# Altium project Nedjabar.PrjPcb
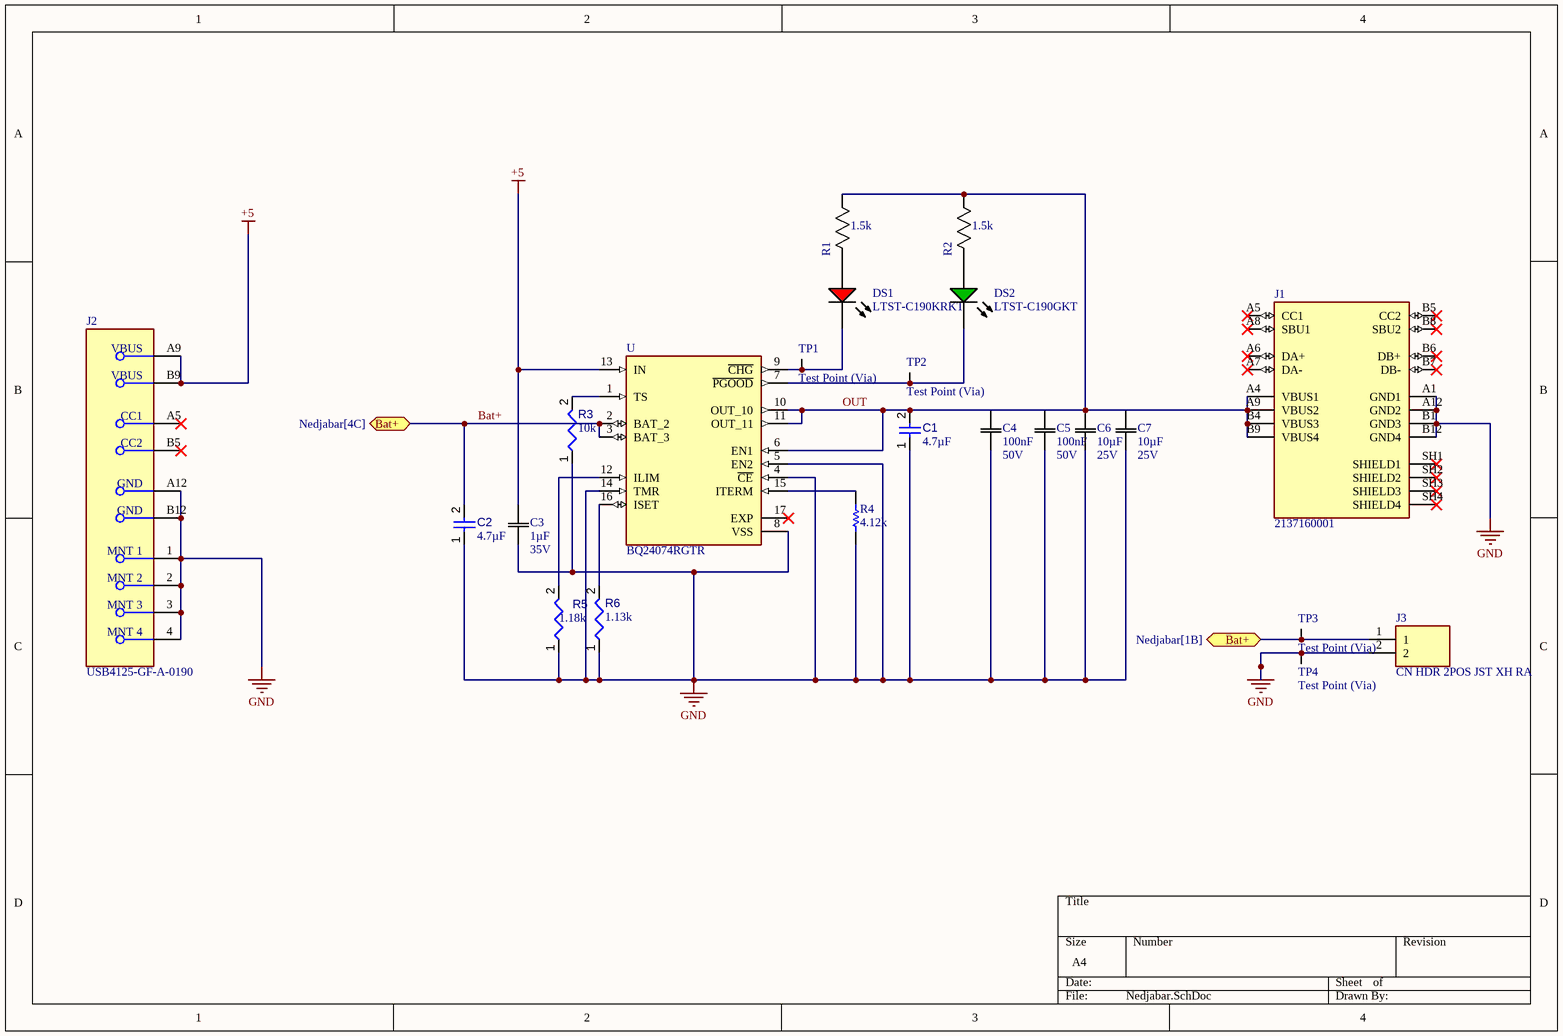
[diagram p0: Nedjabar.SchDoc]
1 sheet, 23 parts. Net scope: flat (ports and power ports of the same name join across sheets).

## Sheet Nedjabar.SchDoc
size A4; SheetNumber: 1; SheetTotal: 1

### Parts
C1  value 4.7µF  [CAPC0805(2012)145_L]  (hidden comment: Capacitor 4.7µF +/-40% 25V 0805)
C2  value 4.7µF  [CAPC0805(2012)145_L]  (hidden comment: Capacitor 4.7µF +/-40% 25V 0805)
C3  value 1µF  Rating: 35V  [0805]  (hidden comment: CAP 1.0uF 35V)
C4  value 100nF  Rating: 50V  [0603]  (hidden comment: CAP 0.1uF 50V)
C5  value 100nF  Rating: 50V  [0603]  (hidden comment: CAP 0.1uF 50V)
C6  value 10µF  Rating: 25V  [1206]  (hidden comment: CAP 10uF 25V)
C7  value 10µF  Rating: 25V  [1206]  (hidden comment: CAP 10uF 25V)
DS1  LTST-C190KRKT  [LTST-C191KRKT_V]
DS2  LTST-C190GKT  [LTST-C190GKT_V]
J1  2137160001  [MOLEX_2137160001]
J2  USB4125-GF-A-0190  [FP-USB4125-GF-A-0190-MFG]
J3  CN HDR 2POS JST XH RA  [JST_S2B-XH-A(LF)(SN)]
R1  value 1.5k  [0603]  (hidden comment: RES 1.5k 1/8W - 1%)
R2  value 1.5k  [0603]  (hidden comment: RES 1.5k 1/8W - 1%)
R3  value 10k  [RESC2013X50X35ML15T15]  (hidden comment: Resistor 10k +/-1% 0805 125 mW)
R4  value 4.12k  [RESC2013X60X35NL10T20]  (hidden comment: Resistor 4k12 +/- 1% 0805)
R5  value 1.18k  [0805 IPC Class B]  (hidden comment: 0603-(1608-Metric))
R6  value 1.13k  [0805 IPC Class B]  (hidden comment: CRCW08051K13FKEA)
TP1  Test Point (Via)  [TP]  (no BOM)
TP2  Test Point (Via)  [TP]  (no BOM)
TP3  Test Point (Via)  [TP]  (no BOM)
TP4  Test Point (Via)  [TP]  (no BOM)
U  BQ24074RGTR  [QFN50P300X300X100-17N]

### Ports
Bat+ (bidir, see Nedjabar[1B]), Bat+ (bidir, see Nedjabar[4C])

### Nets
+5: C3.2(C2) J2.A9(VBUS) J2.B9(VBUS) U.13(IN)
GND: C1.1 C2.1 C3.1(C1) C4.1(C1) C5.1(C1) C6.1(C1) C7.1(C1) J1.A1(GND1) J1.A12(GND2) J1.B1(GND3) J1.B12(GND4) J2.1(MNT_1) J2.2(MNT_2) J2.3(MNT_3) J2.4(MNT_4) J2.A12(GND) J2.B12(GND) J3.2 R3.1 R4.1 R5.1 R6.1 TP4.1 U.4(~{CE}) U.5(EN2) U.8(VSS) U.14(TMR)
Bat+: C2.2 J3.1 TP3.1 U.2(BAT_2) U.3(BAT_3) ; port Bat+
OUT: C1.2 C4.2(C2) C5.2(C2) C6.2(C2) C7.2(C2) J1.A4(VBUS1) J1.A9(VBUS2) J1.B4(VBUS3) J1.B9(VBUS4) R1.1(R1) R2.1(R1) U.6(EN1) U.10(OUT_10) U.11(OUT_11)
NetDS1_1: DS1.1(A) R1.2(R2)
NetDS1_2: DS1.2(K) TP1.1 U.9(~{CHG})
NetDS2_1: DS2.1(A) R2.2(R2)
NetDS2_2: DS2.2(K) TP2.1 U.7(~{PGOOD})
NetR3_2: R3.2 U.1(TS)
NetR4_2: R4.2 U.15(ITERM)
NetR5_2: R5.2 U.12(ILIM)
NetR6_2: R6.2 U.16(ISET)

Not connected (* = marked no-connect by the designer): J1 A5(CC1)* A6(DA+)* A7(DA-)* A8(SBU1)* B5(CC2)* B6(DB+)* B7(DB-)* B8(SBU2)* SH1(SHIELD1)* SH2(SHIELD2)* SH3(SHIELD3)* SH4(SHIELD4)*; J2 A5(CC1)* B5(CC2)*; U 17(EXP)*

### Library data of the parts
C1 C2 = CMP-001-00080-4: Chip Capacitor, 4.7µF +/-40%, 25V, 0805, Thickness 1.45 mm; Tolerance: 20%; Voltage Rating: 25V; Min Operating Temperature: -55°C; Max Operating Temperature: 85°C; Pins: 2; Mounting Technology: SMT; Case/Package: 0805
C3 = CMP-001-00115-1: Temperature Coefficient: X7R; Tolerance: 10%; Part Number: CAP 1.0uF 35V
C4 C5 = CMP-001-00131-1: Tolerance: 10%; Temperature Coefficient: X7R; Part Number: CAP 0.1uF 50V
C6 C7 = CMP-001-00127-1: Temperature Coefficient: X5R; Tolerance: 10%; Part Number: CAP 10uF 25V
DS1 = CMP-007-00024-2: LED Uni-Color Red, 62.5 mW, 25 mA, -30 to 85 degC, 2-Pin SMD, RoHS, Tape and Reel; Manufacturer: Lite-On; Power: 75mW; Forward Voltage: 2V; Luminous Intensity: 54mcd; Lens Style: Diffused; Viewing Angle: 130degrees; Forward Current: 20mA; Manufacturer URL: http://www.us.liteon.com/; Case/Package: 0603; Datasheet Version: Rev. F, 05/2013; Package Reference: C191KRKT; Datasheet URL: http://optoelectronics.liteon.com/upload/download/DS-22-99-0151/S_110_LTST-C190KRKT.pdf; Package Description: 2-Pin Surface Mount Device, Body 1.6 x 0.8 mm; Nominal Vf: 2V; Packaging: TapeandReel; RoHS Compliant: True; Pins: 2; Illumination Colour: Red; Colour: Red; Mounting Technology: SM; Package Quantity: 3000; Min Operating Temperature: -55°C; Max Operating Temperature: 85°C
DS2 = CMP-007-00022-2: LED Uni-Color Green, 100 mW, 30 mA, -55 to 85 degC, 2-Pin SMD, RoHS, Tape and Reel; Manufacturer: Lite-On; Power: 100mW; Forward Voltage: 2.1V; Viewing Angle: 130degrees; Forward Current: 20mA; Luminous Intensity: 6mcd; Lens Style: Clear; Manufacturer URL: http://www.us.liteon.com/; RoHS Compliant: True; Colour: Green; Package Description: 2-Pin Surface Mount Device, Body 1.6 x 0.8 mm; Datasheet URL: http://datasheet.octopart.com/LTST-C190GKT-Lite-On-datasheet-158530.pdf; Datasheet Version: Dec-06; Mounting Technology: SM; Case/Package: 0603; Package Reference: C190GKT; Packaging: TapeandReel; Min Operating Temperature: -55°C; Nominal Vf: 2.1V; Package Quantity: 3000; Illumination Colour: Green; Max Operating Temperature: 85°C; Pins: 2
J1 = 2137160001: USB-C (USB TYPE-C) USB 2.0 Receptacle Connector 24 (16+8 Dummy) Position Through Hole, Right Angle; MF: Molex; SnapEDA_Link: https://www.snapeda.com/parts/2137160001/Molex/view-part/?ref=snap; Package: None; Value: *; MP: 2137160001; Check_prices: https://www.snapeda.com/parts/2137160001/Molex/view-part/?ref=eda
J2 = CMP-245163-000004-1: CONN RCPT TYPE C 6P SMD RA
J3 = CMP-002-00105-1: Pins: 2; Part Number: CN HDR 2POS JST XH RA
R1 R2 = CMP-009-00189-1: Part Number: RES 1.5k 1/8W - 1%
R3 = CMP-009-00018-6: Chip Resistor, 10 KOhm, +/- 1%, 125 mW, -55 to 155 degC, 0805 (2012 Metric); Voltage Rating: 150V; Power: 125mW; RoHS Compliant: True; Case/Package: 0805; Tolerance: 1%; Pins: 2; Mounting Technology: SM; Max Operating Temperature: 155°C; Min Operating Temperature: -55°C
R4 = CMP-009-00396-1: Fixed Resistor, Metal Glaze/thick Film, 0.125W, 4120ohm, 150V, 1% +/-Tol, 100ppm/Cel, Surface Mount, 0805; Power: 125mW; Case/Package: 0805; Mounting Technology: Surface Mount; Pins: 2; Min Operating Temperature: -55°C; RoHS Compliant: Yes; Max Operating Temperature: 155°C; Tolerance: 1%
R5 = CMP-009-00397-1: Fixed Resistor, Metal Glaze/thick Film, 0.125W, 1180ohm, 150V, 1% +/-Tol, 100ppm/Cel, Surface Mount, 0805; Power: 125mW; Case/Package: 0805; RoHS Compliant: Yes; Tolerance: 1%; Pins: 2; Mounting Technology: Surface Mount; Min Operating Temperature: -55°C; Max Operating Temperature: 155°C
R6 = CMP-009-00401-1: Fixed Resistor, Metal Glaze/thick Film, 0.125W, 1130ohm, 150V, 1% +/-Tol, 100ppm/Cel, Surface Mount, 0805; Power: 125mW; Max Operating Temperature: 155°C; Mounting Technology: Surface Mount; RoHS Compliant: Yes; Pins: 2; Min Operating Temperature: -55°C; Tolerance: 1%; Case/Package: 0805
TP1-TP4 = CMP-024-000001-1: Part Number: Test Point (Via)
U = BQ24074RGTR: Standalone 1-cell 1.5-A linear charger, Power Path, 4.2-V VBAT, 10.5-V OVP and 4.4-V VOUT 16-VQFN -40 to 85; MF: Texas Instruments; Texas_Instruments-Purchase-URL: https://snapeda.com/shop?store=Texas+Instruments&id=231063; Mouser-Purchase-URL: https://snapeda.com/shop?store=Mouser&id=231063; Digi-Key_Part_Number: 296-38873-1-ND; Package: VQFN-16 Texas Instruments; SnapEDA_Link: https://www.snapeda.com/parts/BQ24074RGTR/Texas%20Instruments/view-part/231063/?ref=snap; DigiKey-Purchase-URL: https://snapeda.com/shop?store=DigiKey&id=231063; MP: BQ24074RGTR; Value: *; Check_prices: https://www.snapeda.com/parts/BQ24074RGTR/Texas%20Instruments/view-part/231063/?ref=eda